# EasyEDA Pro project devboard.epro, schematic Cartridge_ESP8285

## Sheets
1 Cartridge 1: Create Date: 2024-07-24; Page Name: Cartridge 1; Project Name: RCKid2; Schematic Name: Cartridge_ESP8285; Update Date: 2024-07-24; Company: EasyEDA.com; Drawn: EasyEDA; Page Size: A4; Part Number: JLCPCB-002; Reviewed: EasyEDA; Version: V0.1
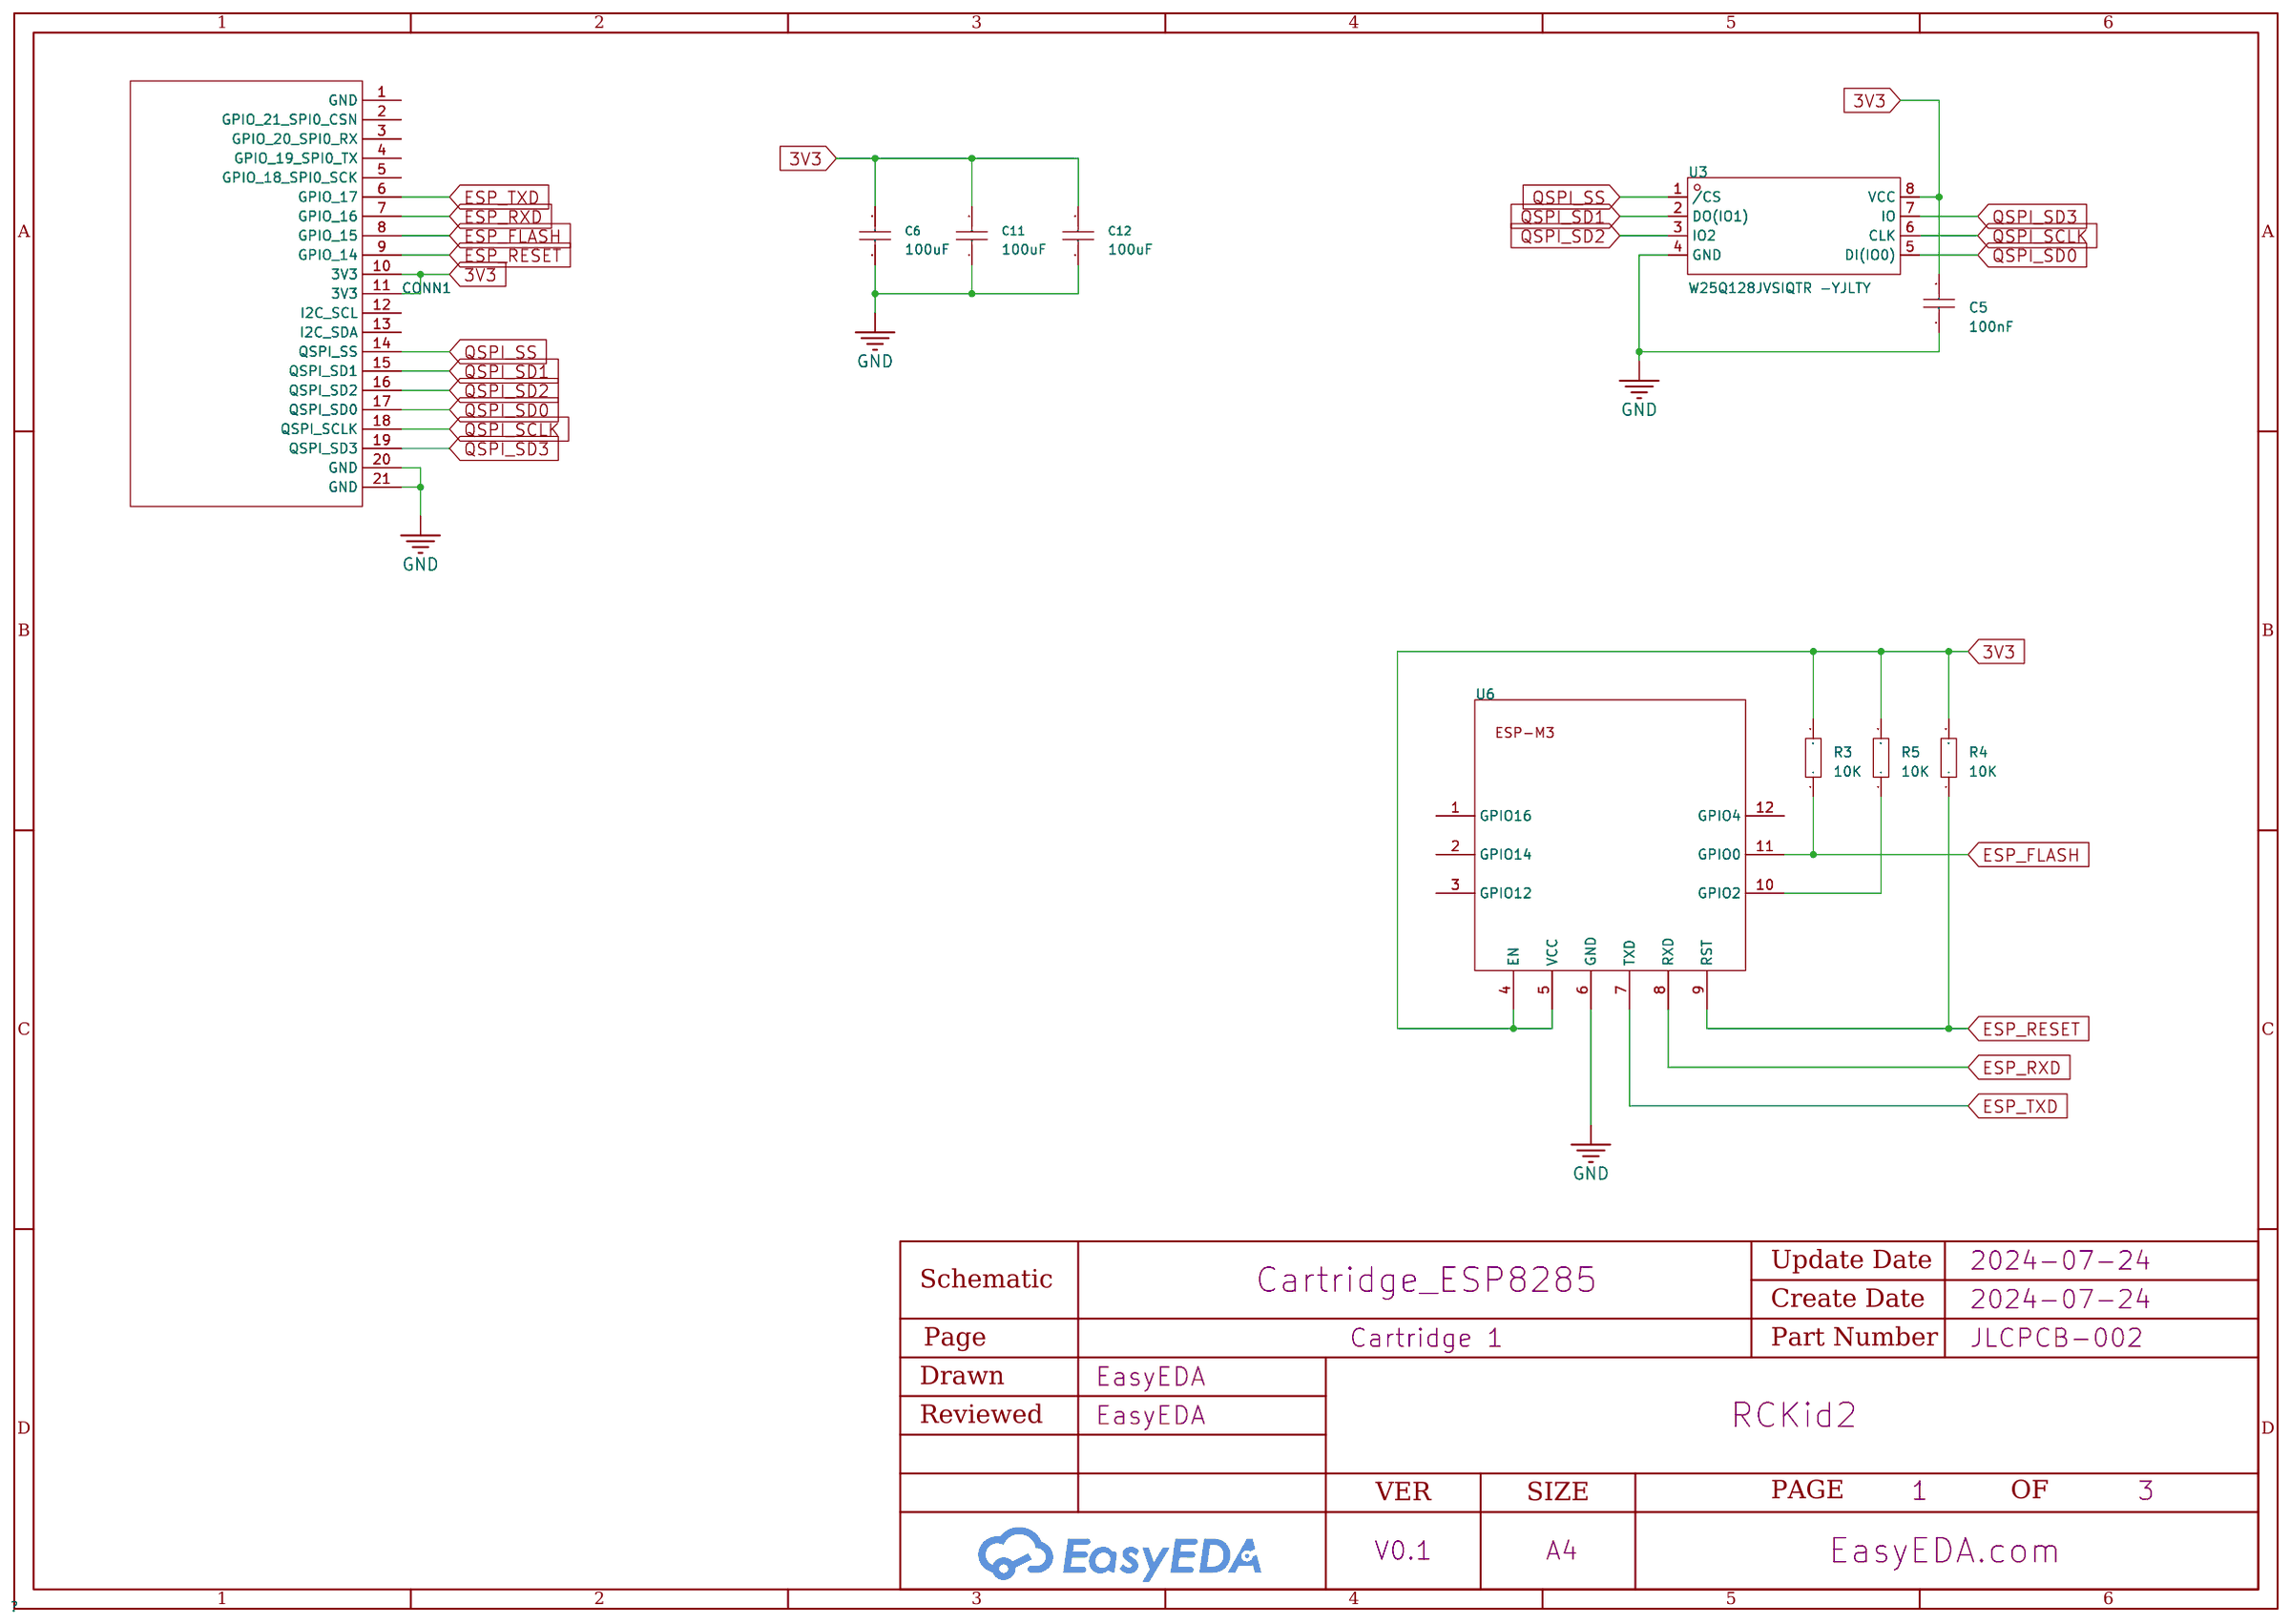
[diagram p3: Cartridge 1]
2 Cartridge 2: Page Name: Cartridge 2
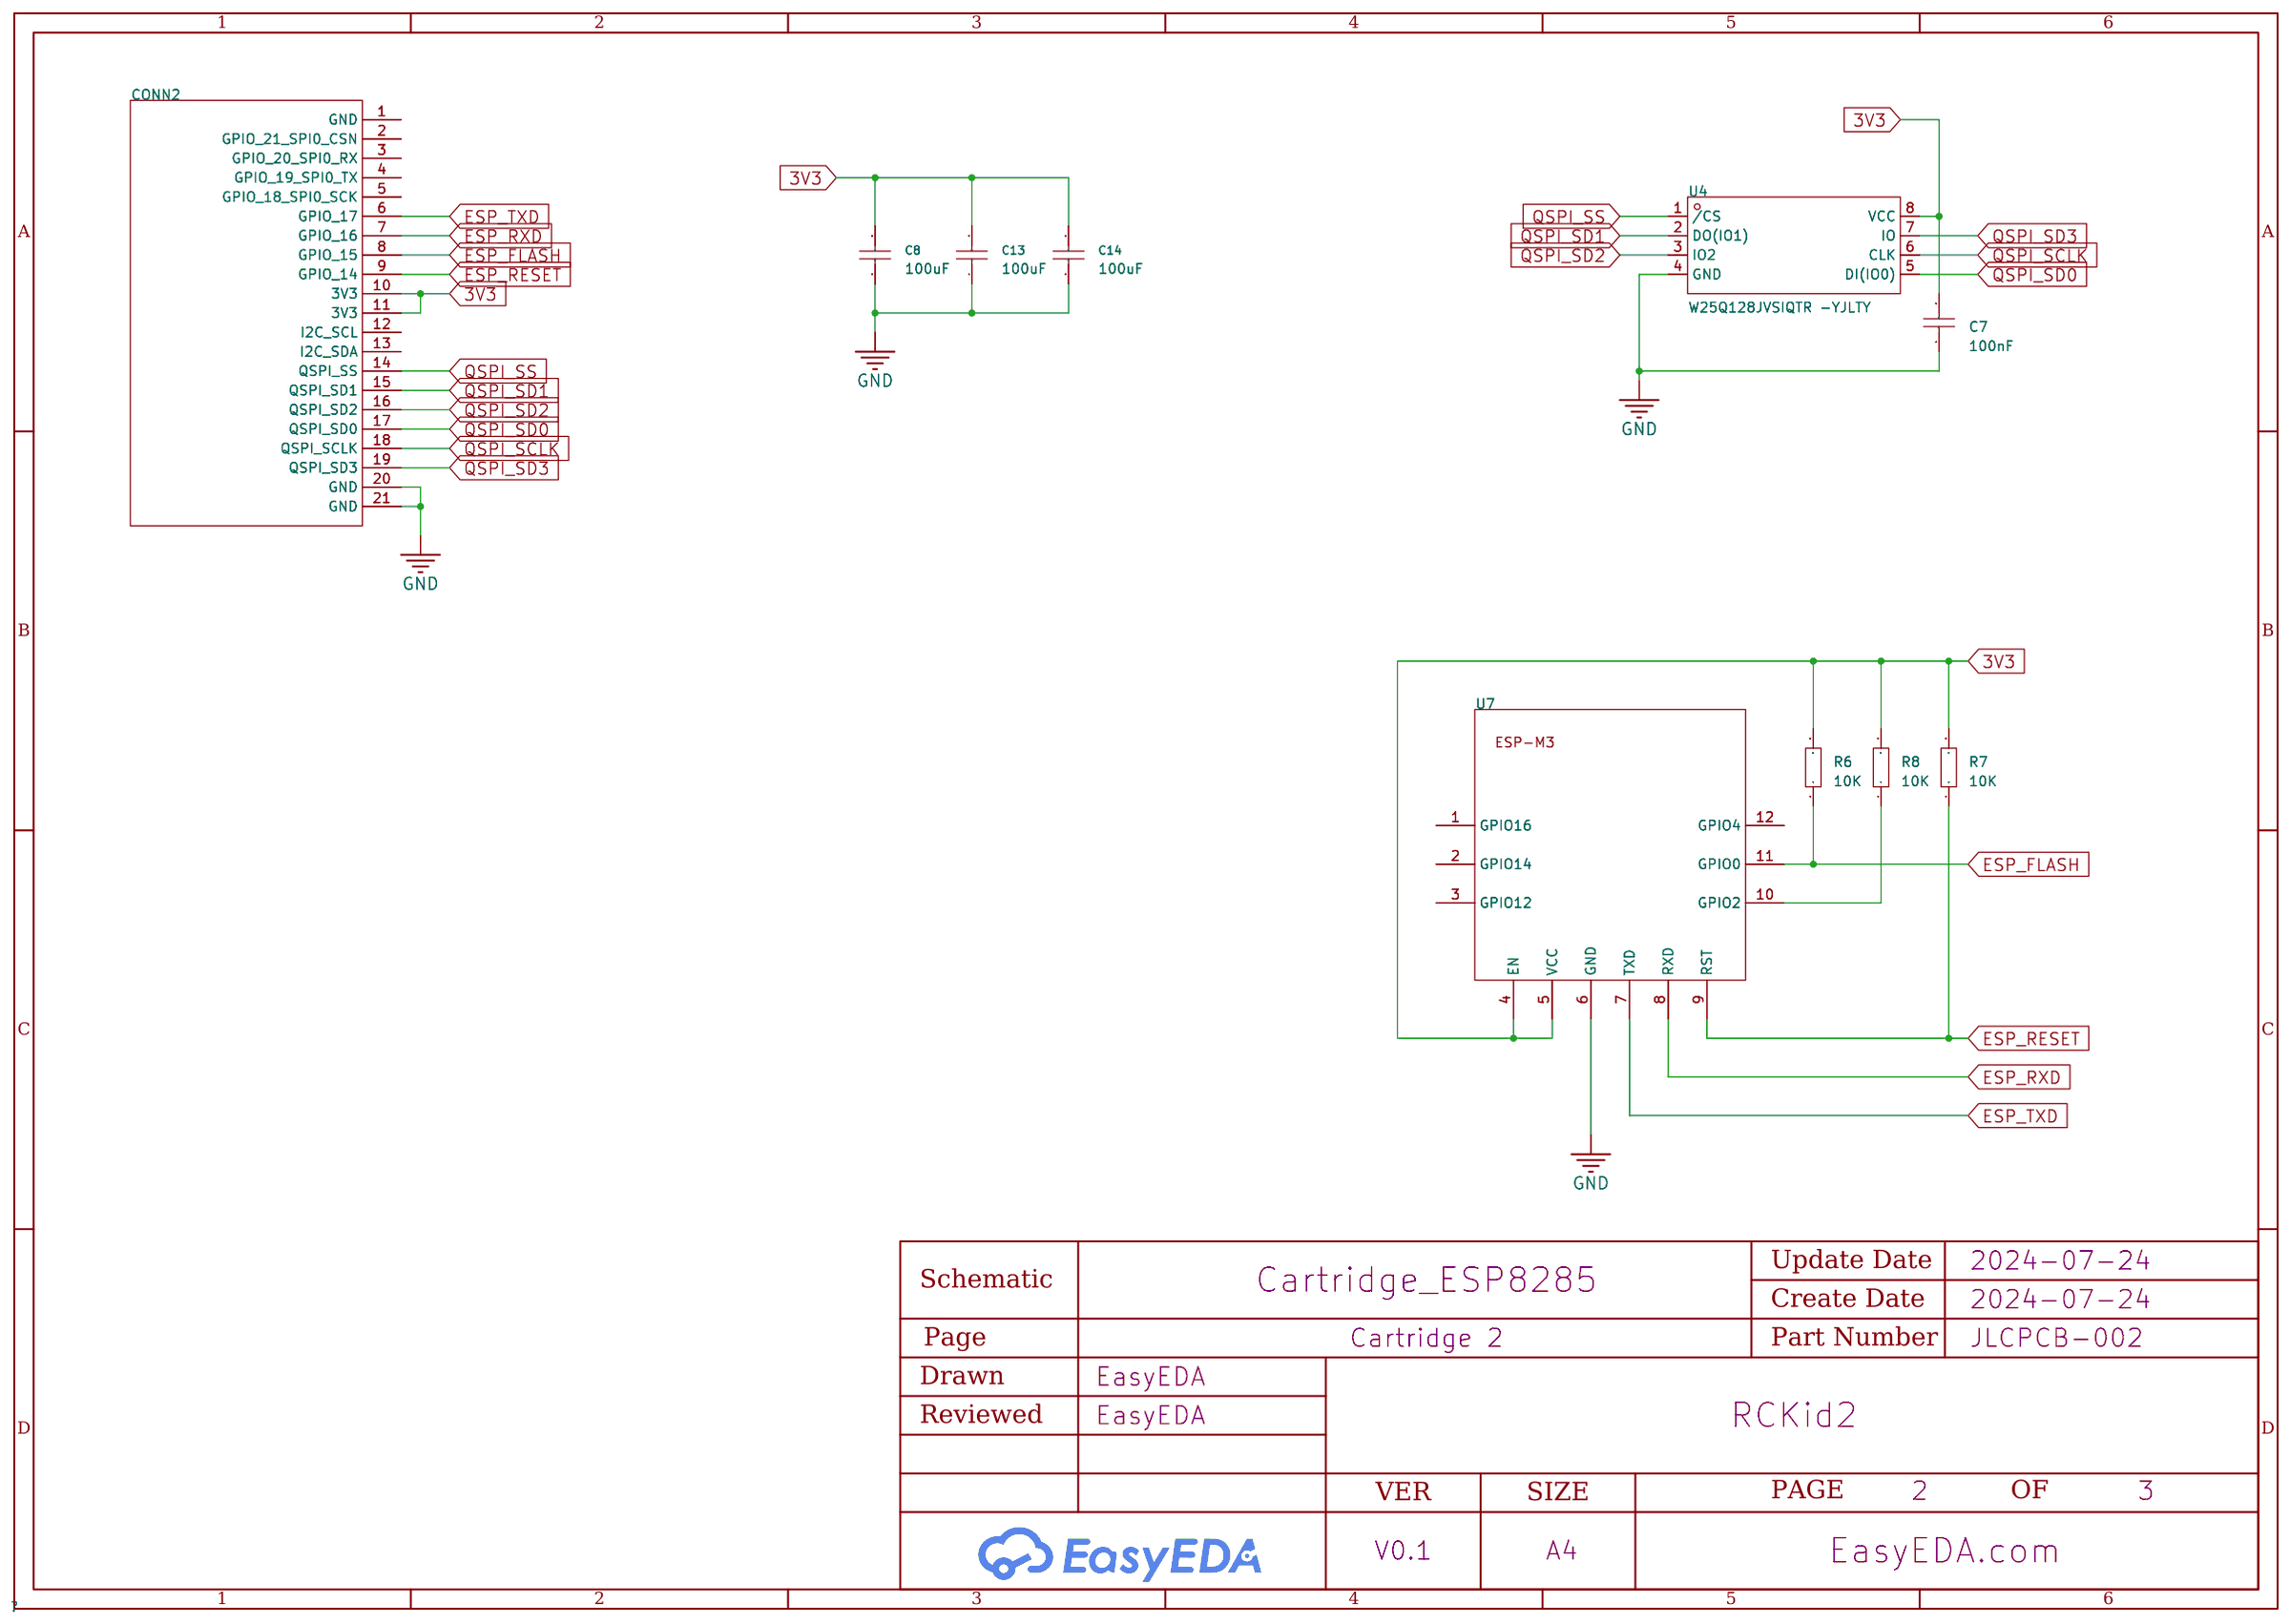
[diagram p4: Cartridge 2]
3 Cartridge 3: Page Name: Cartridge 3
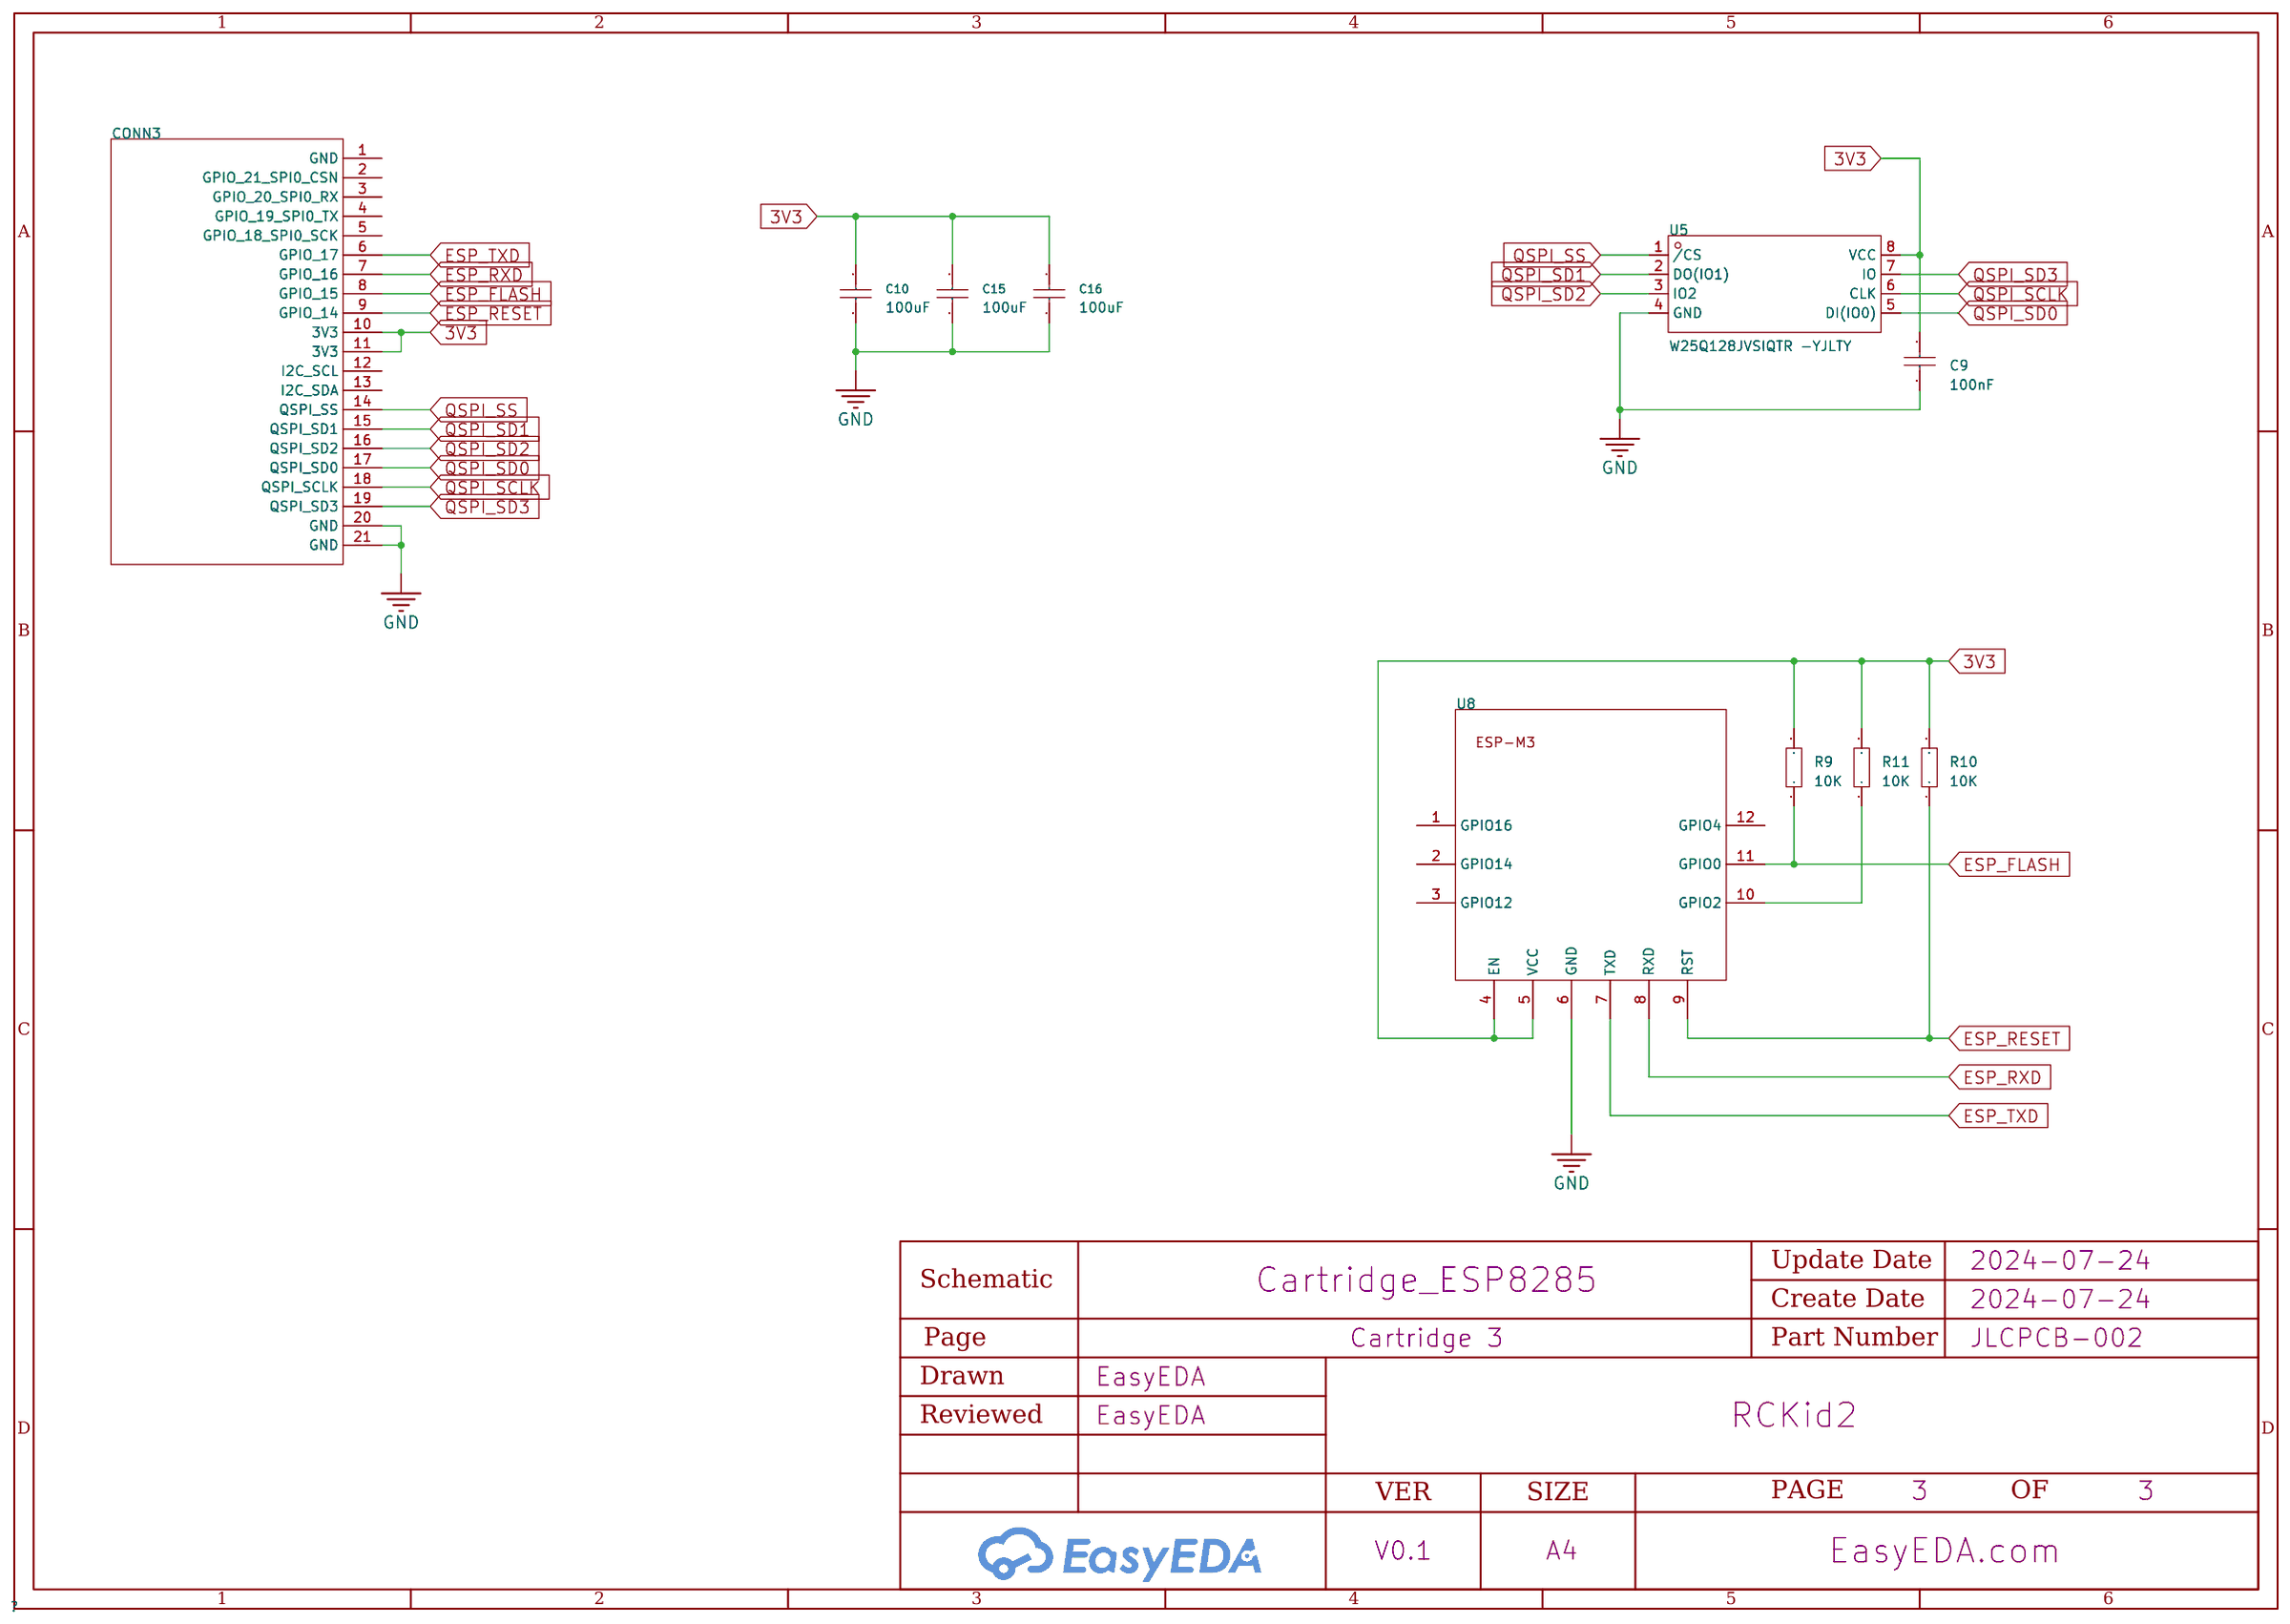
[diagram p5: Cartridge 3]

## Parts
sheet Cartridge 1
C5  100nF  [C0805]
C6  100uF  [C1206]
C11  100uF  [C1206]
C12  100uF  [C1206]
CONN1  -  [RCKid Cartridge Pins]
R3  10K  [R0805]
R4  10K  [R0805]
R5  10K  [R0805]
U3  W25Q128JVSIQTR -YJLTY  [SOIC-8_L5.3-W5.3-P1.27-LS8.0-BL]
U6  -  [ESP-M3]
sheet Cartridge 2
C7  100nF  [C0805]
C8  100uF  [C1206]
C13  100uF  [C1206]
C14  100uF  [C1206]
CONN2  -  [RCKid Cartridge Pins]
R6  10K  [R0805]
R7  10K  [R0805]
R8  10K  [R0805]
U4  W25Q128JVSIQTR -YJLTY  [SOIC-8_L5.3-W5.3-P1.27-LS8.0-BL]
U7  -  [ESP-M3]
sheet Cartridge 3
C9  100nF  [C0805]
C10  100uF  [C1206]
C15  100uF  [C1206]
C16  100uF  [C1206]
CONN3  -  [RCKid Cartridge Pins]
R9  10K  [R0805]
R10  10K  [R0805]
R11  10K  [R0805]
U5  W25Q128JVSIQTR -YJLTY  [SOIC-8_L5.3-W5.3-P1.27-LS8.0-BL]
U8  -  [ESP-M3]

## Library data of the parts
C5 C7 C9 = CL21B104KCFNNNE: Capacitance: Tolerance:±10% Tolerance:±10% Voltage Rated: Temperature Coefficient:; LCSC Part Name: 100nF ±10% 100V; Supplier Part: C28233; Manufacturer: SAMSUNG(三星); Supplier Footprint: 0805; JLCPCB Part Class: Basic Part; Datasheet: https://atta.szlcsc.com/upload/public/pdf/source/20160103/1457707716102.pdf; Supplier: LCSC; Tolerance: ±10%
C6 C8 C10-C16 = CL31A107MQHNNNE: Capacitance: Tolerance:±20% Tolerance:±20% Voltage Rated: Temperature Coefficient:; LCSC Part Name: 100uF±20%6.3V; Supplier Part: C15008; Manufacturer: SAMSUNG(三星); Supplier Footprint: 1206; JLCPCB Part Class: BasicPart; Datasheet: https://atta.szlcsc.com/upload/public/pdf/source/20160103/1457707673200.pdf; Supplier: LCSC; Tolerance: ±20%
CONN1-CONN3 = RCKid2 Cartridge Connector
R3-R11 = Res_0805: Supplier Footprint: 0805
U3-U5 = W25Q128JVSIQTR -YJLTY: LCSC Part Name: 串行闪存; Supplier Part: C2921483; Manufacturer: WINBOND(华邦); Supplier Footprint: SOIC-8-208mil; JLCPCB Part Class: Extended Part; Datasheet: 2021-11-15/642689F/b4c28fe9be624f43904f2fc1db378149/STM32F429IGT6.pdf; Supplier: LCSC
U6-U8 = ESP-M3 (esp 8285)

## Nets
3V3: C5.2 C6.2 C7.2 C8.2 C9.2 C10.2 C11.2 C12.2 C13.2 C14.2 C15.2 C16.2 CONN1.10(3V3) CONN1.11(3V3) CONN2.10(3V3) CONN2.11(3V3) CONN3.10(3V3) CONN3.11(3V3) R3.2 R4.2 R5.2 R6.2 R7.2 R8.2 R9.2 R10.2 R11.2 U3.8(VCC) U4.8(VCC) U5.8(VCC) U6.4(EN) U6.5(VCC) U7.4(EN) U7.5(VCC) U8.4(EN) U8.5(VCC)
GND: C5.1 C6.1 C7.1 C8.1 C9.1 C10.1 C11.1 C12.1 C13.1 C14.1 C15.1 C16.1 CONN1.20(GND) CONN1.21(GND) CONN2.20(GND) CONN2.21(GND) CONN3.20(GND) CONN3.21(GND) U3.4(GND) U4.4(GND) U5.4(GND) U6.6(GND) U7.6(GND) U8.6(GND)
ESP_FLASH: CONN1.8(GPIO_15) CONN2.8(GPIO_15) CONN3.8(GPIO_15) R3.1 R6.1 R9.1 U6.11(GPIO0) U7.11(GPIO0) U8.11(GPIO0)
ESP_RESET: CONN1.9(GPIO_14) CONN2.9(GPIO_14) CONN3.9(GPIO_14) R4.1 R7.1 R10.1 U6.9(RST) U7.9(RST) U8.9(RST)
ESP_RXD: CONN1.7(GPIO_16) CONN2.7(GPIO_16) CONN3.7(GPIO_16) U6.8(RXD) U7.8(RXD) U8.8(RXD)
ESP_TXD: CONN1.6(GPIO_17) CONN2.6(GPIO_17) CONN3.6(GPIO_17) U6.7(TXD) U7.7(TXD) U8.7(TXD)
QSPI_SCLK: CONN1.18(QSPI_SCLK) CONN2.18(QSPI_SCLK) CONN3.18(QSPI_SCLK) U3.6(CLK) U4.6(CLK) U5.6(CLK)
QSPI_SD0: CONN1.17(QSPI_SD0) CONN2.17(QSPI_SD0) CONN3.17(QSPI_SD0) U3.5(DI(IO0)) U4.5(DI(IO0)) U5.5(DI(IO0))
QSPI_SD1: CONN1.15(QSPI_SD1) CONN2.15(QSPI_SD1) CONN3.15(QSPI_SD1) U3.2(DO(IO1)) U4.2(DO(IO1)) U5.2(DO(IO1))
QSPI_SD2: CONN1.16(QSPI_SD2) CONN2.16(QSPI_SD2) CONN3.16(QSPI_SD2) U3.3(IO2) U4.3(IO2) U5.3(IO2)
QSPI_SD3: CONN1.19(QSPI_SD3) CONN2.19(QSPI_SD3) CONN3.19(QSPI_SD3) U3.7(IO) U4.7(IO) U5.7(IO)
QSPI_SS: CONN1.14(QSPI_SS) CONN2.14(QSPI_SS) CONN3.14(QSPI_SS) U3.1(/CS) U4.1(/CS) U5.1(/CS)
$1N1111: R5.1 U6.10(GPIO2)
$2N755: R8.1 U7.10(GPIO2)
$3N755: R11.1 U8.10(GPIO2)

Not connected (* = marked no-connect by the designer): CONN1 1(GND) 2(GPIO_21_SPI0_CSN) 3(GPIO_20_SPI0_RX) 4(GPIO_19_SPI0_TX) 5(GPIO_18_SPI0_SCK) 12(I2C_SCL) 13(I2C_SDA); CONN2 1(GND) 2(GPIO_21_SPI0_CSN) 3(GPIO_20_SPI0_RX) 4(GPIO_19_SPI0_TX) 5(GPIO_18_SPI0_SCK) 12(I2C_SCL) 13(I2C_SDA); CONN3 1(GND) 2(GPIO_21_SPI0_CSN) 3(GPIO_20_SPI0_RX) 4(GPIO_19_SPI0_TX) 5(GPIO_18_SPI0_SCK) 12(I2C_SCL) 13(I2C_SDA); U6 1(GPIO16) 2(GPIO14) 3(GPIO12) 12(GPIO4); U7 1(GPIO16) 2(GPIO14) 3(GPIO12) 12(GPIO4); U8 1(GPIO16) 2(GPIO14) 3(GPIO12) 12(GPIO4)
